# EAGLE schematic ControleCamera (EAGLE 6.5.0)
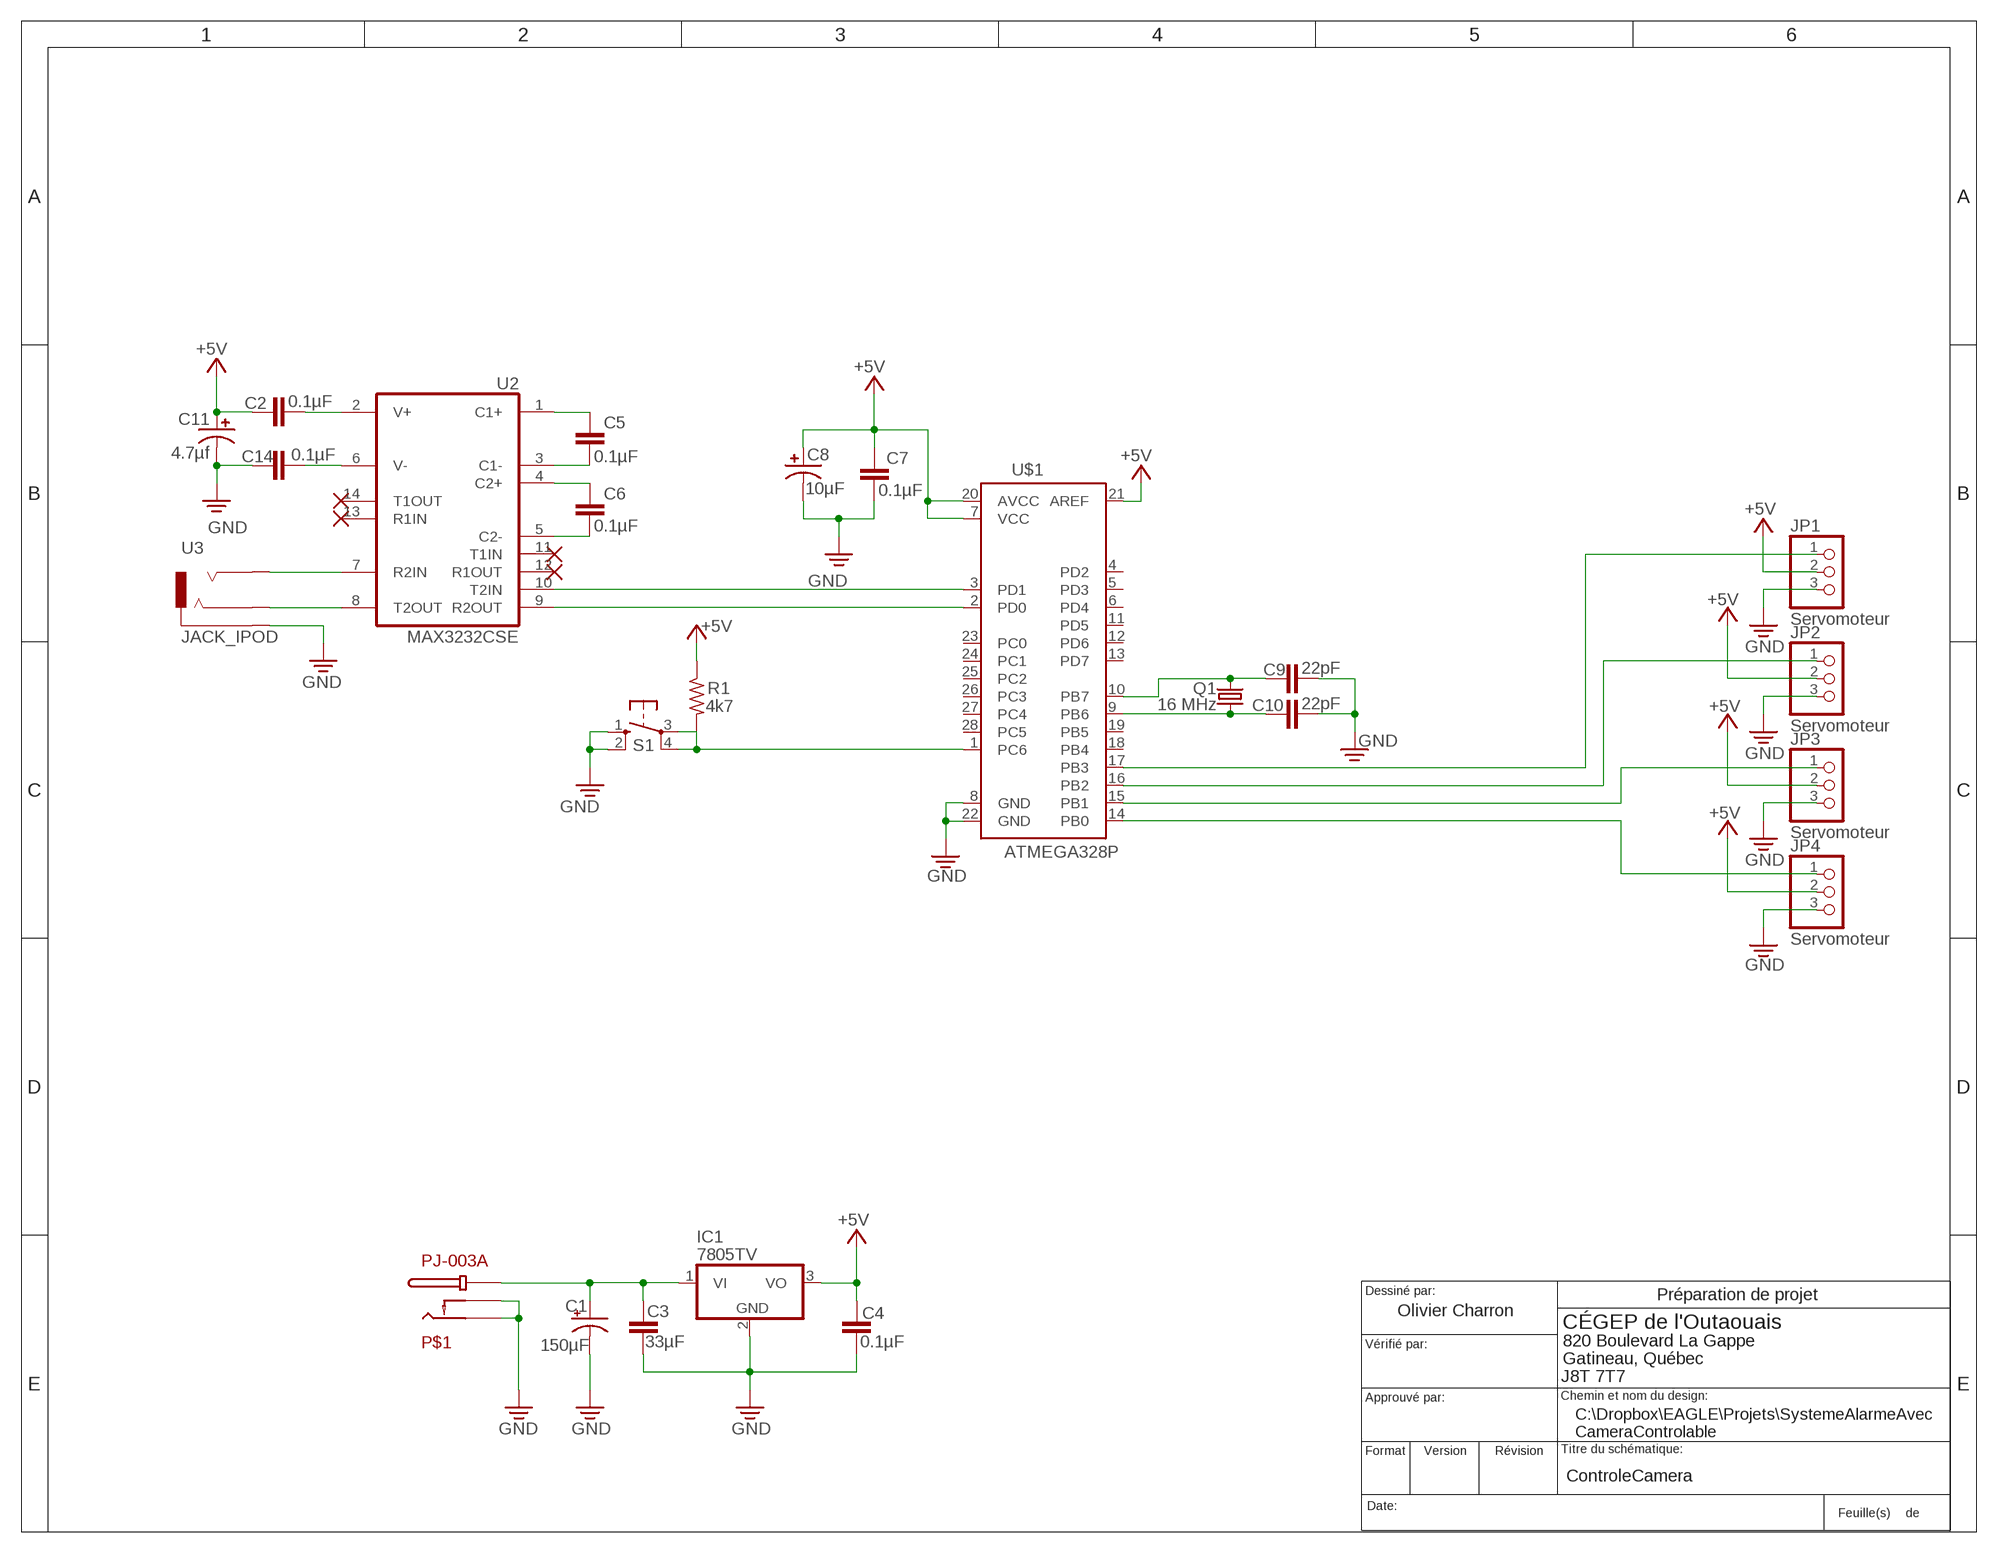
[diagram p0: schematic, sheet 1]

## Parts
C1  150µF  CPOL-USD/7343-31R  [D/7343-31R]
C2  0.1µF  C-EUC0805  [C0805]
C3  33µF  C-EUC0805  [C0805]
C4  0.1µF  C-EUC0805  [C0805]
C5  0.1µF  C-EUC0805  [C0805]
C6  0.1µF  C-EUC0805  [C0805]
C7  0.1µF  C-EUC1210  [C1210]
C8  10µF  C-USC1206  [C1206]
C9  22pF  C-EUC1210  [C1210]
C10  22pF  C-EUC1210  [C1210]
C11  4.7µf  C-USC0805  [C0805]
C14  0.1µF  C-EUC0805  [C0805]
FRAME1  CARTOUCHE_TGÉ  [CARTOUCHE]
IC1  7805TV  [TO220V]
JP1  Servomoteur  PINHD-1X3  [1X03]
JP2  Servomoteur  PINHD-1X3  [1X03]
JP3  Servomoteur  PINHD-1X3  [1X03]
JP4  Servomoteur  PINHD-1X3  [1X03]
P$1  PJ-003A  [PJ-003A-FP]
Q1  16 MHz  CRYSTALHC49S  [HC49/S]
R1  4k7  R-US_M1206  [M1206]
S1  10-XX  [B3F-10XX]
U2  MAX3232CSE  [SO16]
U3  JACK_IPOD  [STEREO_3,5MM]
U$1  ATMEGA328P  [DIL32]

## Nets
+5V: C2.2 C4.1 C7.2 C8.1 C11.1 IC1.3(VO) JP1.2 JP2.2 JP3.2 JP4.2 R1.1 U$1.7(VCC) U$1.20(AVCC) U$1.21(AREF)
GND: C1.- C3.2 C4.2 C9.1 C10.1 C11.2 C14.1 IC1.2(GND) JP1.3 JP2.3 JP3.3 JP4.3 P$1.P$2(GND) P$1.P$3(GND) S1.1(S) S1.2(S1) U3.P$1(REF) U$1.8(GND) U$1.22(GND)
N$1: C1.+ C3.1 IC1.1(VI) P$1.P$1(+DCIN)
N$2: C5.1 U2.1(C1+)
N$3: C5.2 U2.3(C1-)
N$4: C6.1 U2.4(C2+)
N$5: C6.2 U2.5(C2-)
N$13: C9.2 Q1.1 U$1.10(PB7)
N$14: C2.1 U2.2(V+)
N$15: C14.2 U2.6(V-)
N$17: U2.7(R2IN) U3.P$2
N$18: U2.8(T2OUT) U3.P$3
N$19: C10.2 Q1.2 U$1.9(PB6)
N$21: R1.2 S1.3(P) S1.4(P1) U$1.1(PC6)
N$22: C7.1 C8.2 ; supply symbol labelled GND
N$23: U2.9(R2OUT) U$1.2(PD0)
N$24: U2.10(T2IN) U$1.3(PD1)
N$27: JP1.1 U$1.17(PB3)
N$28: JP2.1 U$1.16(PB2)
N$29: JP3.1 U$1.15(PB1)
N$30: JP4.1 U$1.14(PB0)
Unconnected: U2.11(T1IN) U2.12(R1OUT) U2.13(R1IN) U2.14(T1OUT) U$1.4(PD2) U$1.5(PD3) U$1.6(PD4) U$1.11(PD5) U$1.12(PD6) U$1.13(PD7) U$1.18(PB4) U$1.19(PB5) U$1.23(PC0) U$1.24(PC1) U$1.25(PC2) U$1.26(PC3) U$1.27(PC4) U$1.28(PC5)

## Notes on the sheet
- Écran tactile
- Capteur magnétique | Indicateurs lumineux
- Microcontrôleur | Tourelle
- Interrupteur
       à clé
- Sirène
- Lecteur d'empreinte 
           digitale
- Joystick
- Moniteur
- Ordinateur
- Caméra
- Préparation de projet
- C:\\Dropbox\\EAGLE\\Projets\\SystemeAlarmeAvec
  CameraControlable

## Power pins joined to a net without a drawn wire
GND: U2.15(GND)
VCC: U2.16(VCC)

## Library data of the parts
C1 = rcl:CPOL-US: POLARIZED CAPACITOR, American symbol
C2-C7 C9 C10 C14 = rcl:C-EU: CAPACITOR, European symbol
C8 C11 = rcl:C-US: CAPACITOR, American symbol
FRAME1 = 1_TGE-sur G:CARTOUCHE_TGÉ: Cartouche de TGÉ: Grandeur A, dimention 8 1/2 x 11 pouces, orientation portrait. Les élèves doivent utiliser la commande TEXT pour placer les valeurs aux champs appropriés. Couche 100 Cartouche, ne pas oublier de créer cette couche! Size par défaut: 0,07 ou ajusté en conséquence si pas asez d'espace. Ratio: 8% Font: Vector. Voir la commande TEXT pour plus d'information.
IC1 = linear:78*: Positive VOLTAGE REGULATOR Source: http://cache.national.com/ds/LM/LM78L05.pdf http://www.fairchildsemi.com/ds/LM/LM7805.pdf
JP1-JP4 = 1mylib:PINHD-1X3: PIN HEADER
P$1 = 1mylib:PJ-003A
Q1 = crystal:CRYSTAL: CRYSTAL; OC_FARNELL: 1667008; OC_NEWARK: unknown
R1 = rcl:R-US_: RESISTOR, American symbol
S1 = switch-omron:10-XX: OMRON SWITCH; MPN: B3F-1000; OC_FARNELL: 176432; OC_NEWARK: 36M3542
U2 = 1_TGE-sur G:MAX3232*: True RS-232 Transceivers 3.0V to 5.5V, Low-Power up to 1Mbps, Using Four 0.1µF External Capacitors Source: http://pdfserv.maxim-ic.com/en/ds/MAX3222-MAX3241.pdf; MPN: MAX3232CSE; OC_FARNELL: 9725490; OC_NEWARK: 90C2890
U3 = 1mylib:JACK_IPOD
U$1 = SystemeAlarmeCameraController:ATMEGA328P